# Altium schematic sheet PMIC AXP223.SchDoc
size A3; SheetNumber: 7; SheetTotal: 12
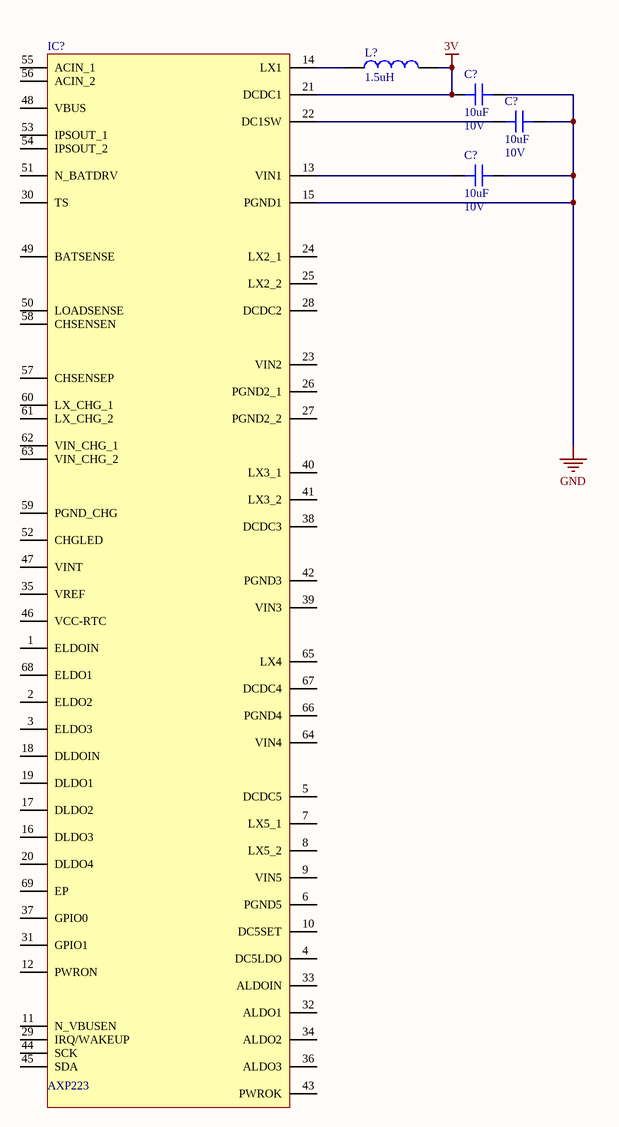
[diagram p0: PMIC AXP223.SchDoc]

## Parts
(Parts that share a designator on the sheet are numbered #1, #2 ... from top to bottom, then left to right.)
C?#1  Voltage: 10V  [CAPC2012X14N]  (hidden comment: 10uF)
C?#2  Voltage: 10V  [CAPC2012X14N]  (hidden comment: 10uF)
C?#3  Voltage: 10V  [CAPC2012X14N]  (hidden comment: 10uF)
IC?  AXP223  [QFN40P800X800X80-69N-D]
L?  1.5uH  [INDP400L400WX180_N]

## Nets
3V: C?#1.2 IC?.21(DCDC1) L?.2
GND: C?#1.1 C?#2.1 C?#3.1 IC?.15(PGND1)
NetC?#2_2: C?#2.2 IC?.22(DC1SW)
NetC?#3_2: C?#3.2 IC?.13(VIN1)
NetIC?_14: IC?.14(LX1) L?.1

Not connected (* = marked no-connect by the designer): IC? 1(ELDOIN) 2(ELDO2) 3(ELDO3) 4(DC5LDO) 5(DCDC5) 6(PGND5) 7(LX5_1) 8(LX5_2) 9(VIN5) 10(DC5SET) 11(N_VBUSEN) 12(PWRON) 16(DLDO3) 17(DLDO2) 18(DLDOIN) 19(DLDO1) 20(DLDO4) 23(VIN2) 24(LX2_1) 25(LX2_2) 26(PGND2_1) 27(PGND2_2) 28(DCDC2) 29(IRQ/WAKEUP) 30(TS) 31(GPIO1) 32(ALDO1) 33(ALDOIN) 34(ALDO2) 35(VREF) 36(ALDO3) 37(GPIO0) 38(DCDC3) 39(VIN3) 40(LX3_1) 41(LX3_2) 42(PGND3) 43(PWROK) 44(SCK) 45(SDA) 46(VCC-RTC) 47(VINT) 48(VBUS) 49(BATSENSE) 50(LOADSENSE) 51(N_BATDRV) 52(CHGLED) 53(IPSOUT_1) 54(IPSOUT_2) 55(ACIN_1) 56(ACIN_2) 57(CHSENSEP) 58(CHSENSEN) 59(PGND_CHG) 60(LX_CHG_1) 61(LX_CHG_2) 62(VIN_CHG_1) 63(VIN_CHG_2) 64(VIN4) 65(LX4) 66(PGND4) 67(DCDC4) 68(ELDO1) 69(EP)

## Library data of the parts
C?#1-C?#3 = 0805B106K100NT: Manufacturer: FH (Guangdong Fenghua Advanced Tech); Tolerance: 10%; Dielectric: X7R; Min Temperature: -55; Max Temperature: 125; Part Number: 0805B106K100NT; ComponentLink1URL: https://datasheet.lcsc.com/lcsc/2304140030_FH--Guangdong-Fenghua-Advanced-Tech-0805B106K100NT_C90544.pdf; ComponentLink1Description: Datasheet; Package: 0805; Part Status: Active; Capacitance: 10uF
IC? = AXP223: Integrated Circuit; MANUFACTURER: X-Powers Tech; Part Number: AXP223; COMPONENTLINK1URL: https://datasheet.lcsc.com/lcsc/2204191745_X-Powers-Tech-AXP223_C2997893.pdf; COMPONENTLINK1DESCRIPTION: Datasheet; PACKAGE: QFN-68EP; Part Status: Active
L? = SWPA4018S1R5NT: MANUFACTURER: Sunlord; TOLERANCE: 30%; RESISTANCE: 0.039; SELF RESONANT FREQUENCY: 65MHz; RATED CURRENT: 1.8A; SATURATION CURRENT: 3.35A; Part Number: SWPA4018S1R5NT; COMPONENTLINK1URL: https://datasheet.lcsc.com/lcsc/2110091630_Sunlord-SWPA4018S1R5NT_C80662.pdf; COMPONENTLINK1DESCRIPTION: Datasheet; PACKAGE: 4018; Part Status: Active; INDUCTANCE: 1.5uH